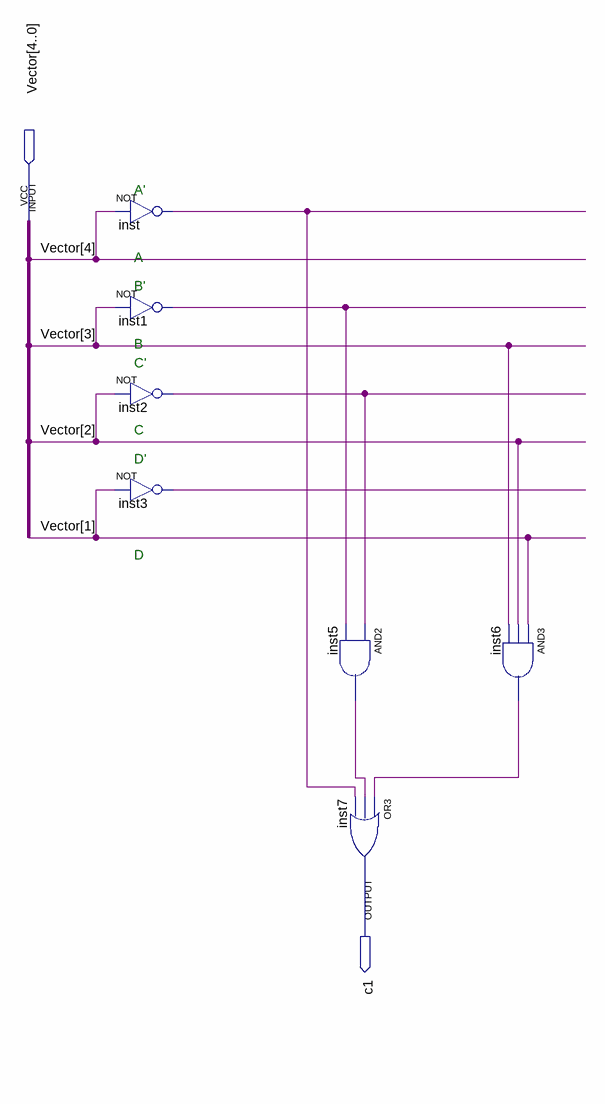
[diagram p0: schematic sheet]
// Quartus schematic c1.bdf as structural Verilog: 7 symbols, 2 pins
module c1 (
  input  [4:0] Vector,
  output c1
);

  wire inst1_out, inst2_out, inst3_out, inst5_out, inst6_out, inst_out;

  not inst (inst_out, Vector[4]);
  not inst1 (inst1_out, Vector[3]);
  not inst2 (inst2_out, Vector[2]);
  not inst3 (inst3_out, Vector[1]);
  and inst5 (inst5_out, inst2_out, inst1_out);
  or inst7 (c1, inst6_out, inst5_out, inst_out);
  and inst6 (inst6_out, Vector[1], Vector[2], Vector[3]);

  // Notes on the sheet:
  //   A'
  //   A
  //   B'
  //   B
  //   C'
  //   C
  //   D'
  //   D
endmodule
